# Altium schematic sheet Sheet1.SchDoc
size B; SheetNumber: 1; SheetTotal: 1; SPICEModelCacheTIBODPLU: <root> / <DocumentId>TIBODPLU</DocumentId> / </root>
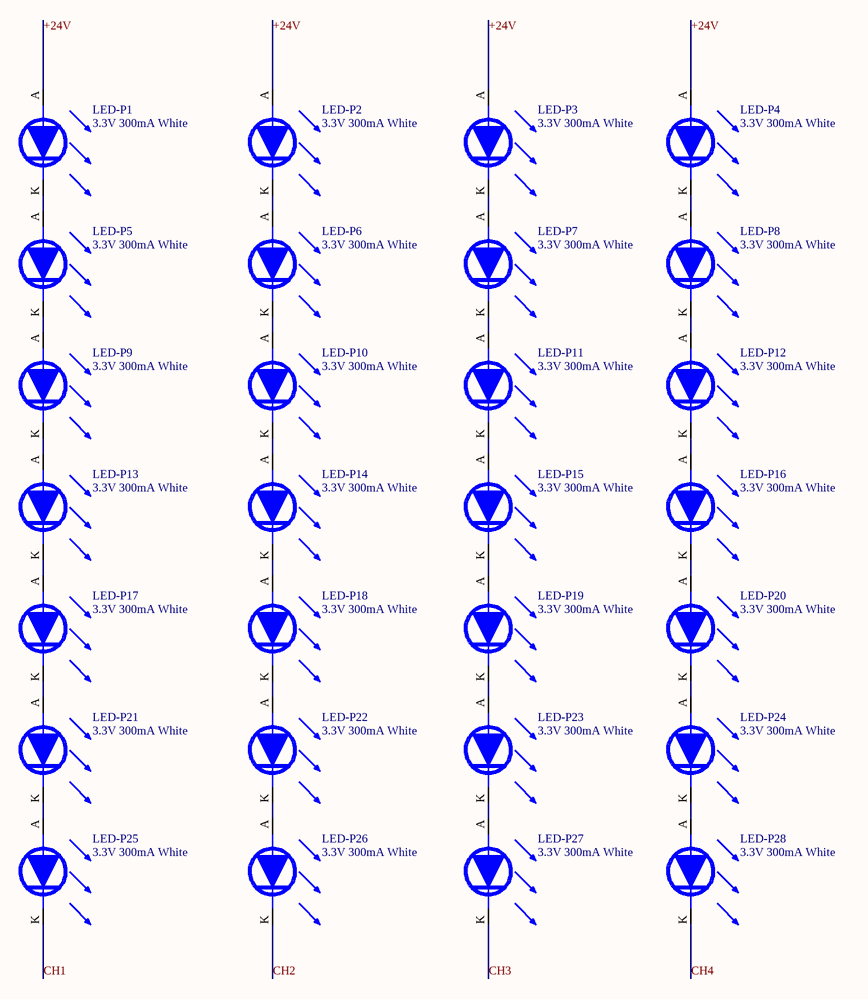
[diagram p0: Sheet1.SchDoc]

## Parts
LED-P1  3.3V 300mA White  [PCBComponent_1]
LED-P2  3.3V 300mA White  [PCBComponent_1]
LED-P3  3.3V 300mA White  [PCBComponent_1]
LED-P4  3.3V 300mA White  [PCBComponent_1]
LED-P5  3.3V 300mA White  [PCBComponent_1]
LED-P6  3.3V 300mA White  [PCBComponent_1]
LED-P7  3.3V 300mA White  [PCBComponent_1]
LED-P8  3.3V 300mA White  [PCBComponent_1]
LED-P9  3.3V 300mA White  [PCBComponent_1]
LED-P10  3.3V 300mA White  [PCBComponent_1]
LED-P11  3.3V 300mA White  [PCBComponent_1]
LED-P12  3.3V 300mA White  [PCBComponent_1]
LED-P13  3.3V 300mA White  [PCBComponent_1]
LED-P14  3.3V 300mA White  [PCBComponent_1]
LED-P15  3.3V 300mA White  [PCBComponent_1]
LED-P16  3.3V 300mA White  [PCBComponent_1]
LED-P17  3.3V 300mA White  [PCBComponent_1]
LED-P18  3.3V 300mA White  [PCBComponent_1]
LED-P19  3.3V 300mA White  [PCBComponent_1]
LED-P20  3.3V 300mA White  [PCBComponent_1]
LED-P21  3.3V 300mA White  [PCBComponent_1]
LED-P22  3.3V 300mA White  [PCBComponent_1]
LED-P23  3.3V 300mA White  [PCBComponent_1]
LED-P24  3.3V 300mA White  [PCBComponent_1]
LED-P25  3.3V 300mA White  [PCBComponent_1]
LED-P26  3.3V 300mA White  [PCBComponent_1]
LED-P27  3.3V 300mA White  [PCBComponent_1]
LED-P28  3.3V 300mA White  [PCBComponent_1]

## Nets
+24V: LED-P1.A LED-P2.A LED-P3.A LED-P4.A
CH1: LED-P25.K
CH2: LED-P26.K
CH3: LED-P27.K
CH4: LED-P28.K
NetLED-P1_K: LED-P1.K LED-P5.A
NetLED-P2_K: LED-P2.K LED-P6.A
NetLED-P3_K: LED-P3.K LED-P7.A
NetLED-P4_K: LED-P4.K LED-P8.A
NetLED-P5_K: LED-P5.K LED-P9.A
NetLED-P6_K: LED-P6.K LED-P10.A
NetLED-P7_K: LED-P7.K LED-P11.A
NetLED-P8_K: LED-P8.K LED-P12.A
NetLED-P9_K: LED-P9.K LED-P13.A
NetLED-P10_K: LED-P10.K LED-P14.A
NetLED-P11_K: LED-P11.K LED-P15.A
NetLED-P12_K: LED-P12.K LED-P16.A
NetLED-P13_K: LED-P13.K LED-P17.A
NetLED-P14_K: LED-P14.K LED-P18.A
NetLED-P15_K: LED-P15.K LED-P19.A
NetLED-P16_K: LED-P16.K LED-P20.A
NetLED-P17_K: LED-P17.K LED-P21.A
NetLED-P18_K: LED-P18.K LED-P22.A
NetLED-P19_K: LED-P19.K LED-P23.A
NetLED-P20_K: LED-P20.K LED-P24.A
NetLED-P21_K: LED-P21.K LED-P25.A
NetLED-P22_K: LED-P22.K LED-P26.A
NetLED-P23_K: LED-P23.K LED-P27.A
NetLED-P24_K: LED-P24.K LED-P28.A

## Library data of the parts
LED-P1-LED-P28 = LED white P1: High power 1W light emitting diode White